# Altium schematic sheet 5.USB3.SchDoc
size 420 x 297 mm; SheetNumber: 5; SheetTotal: 13
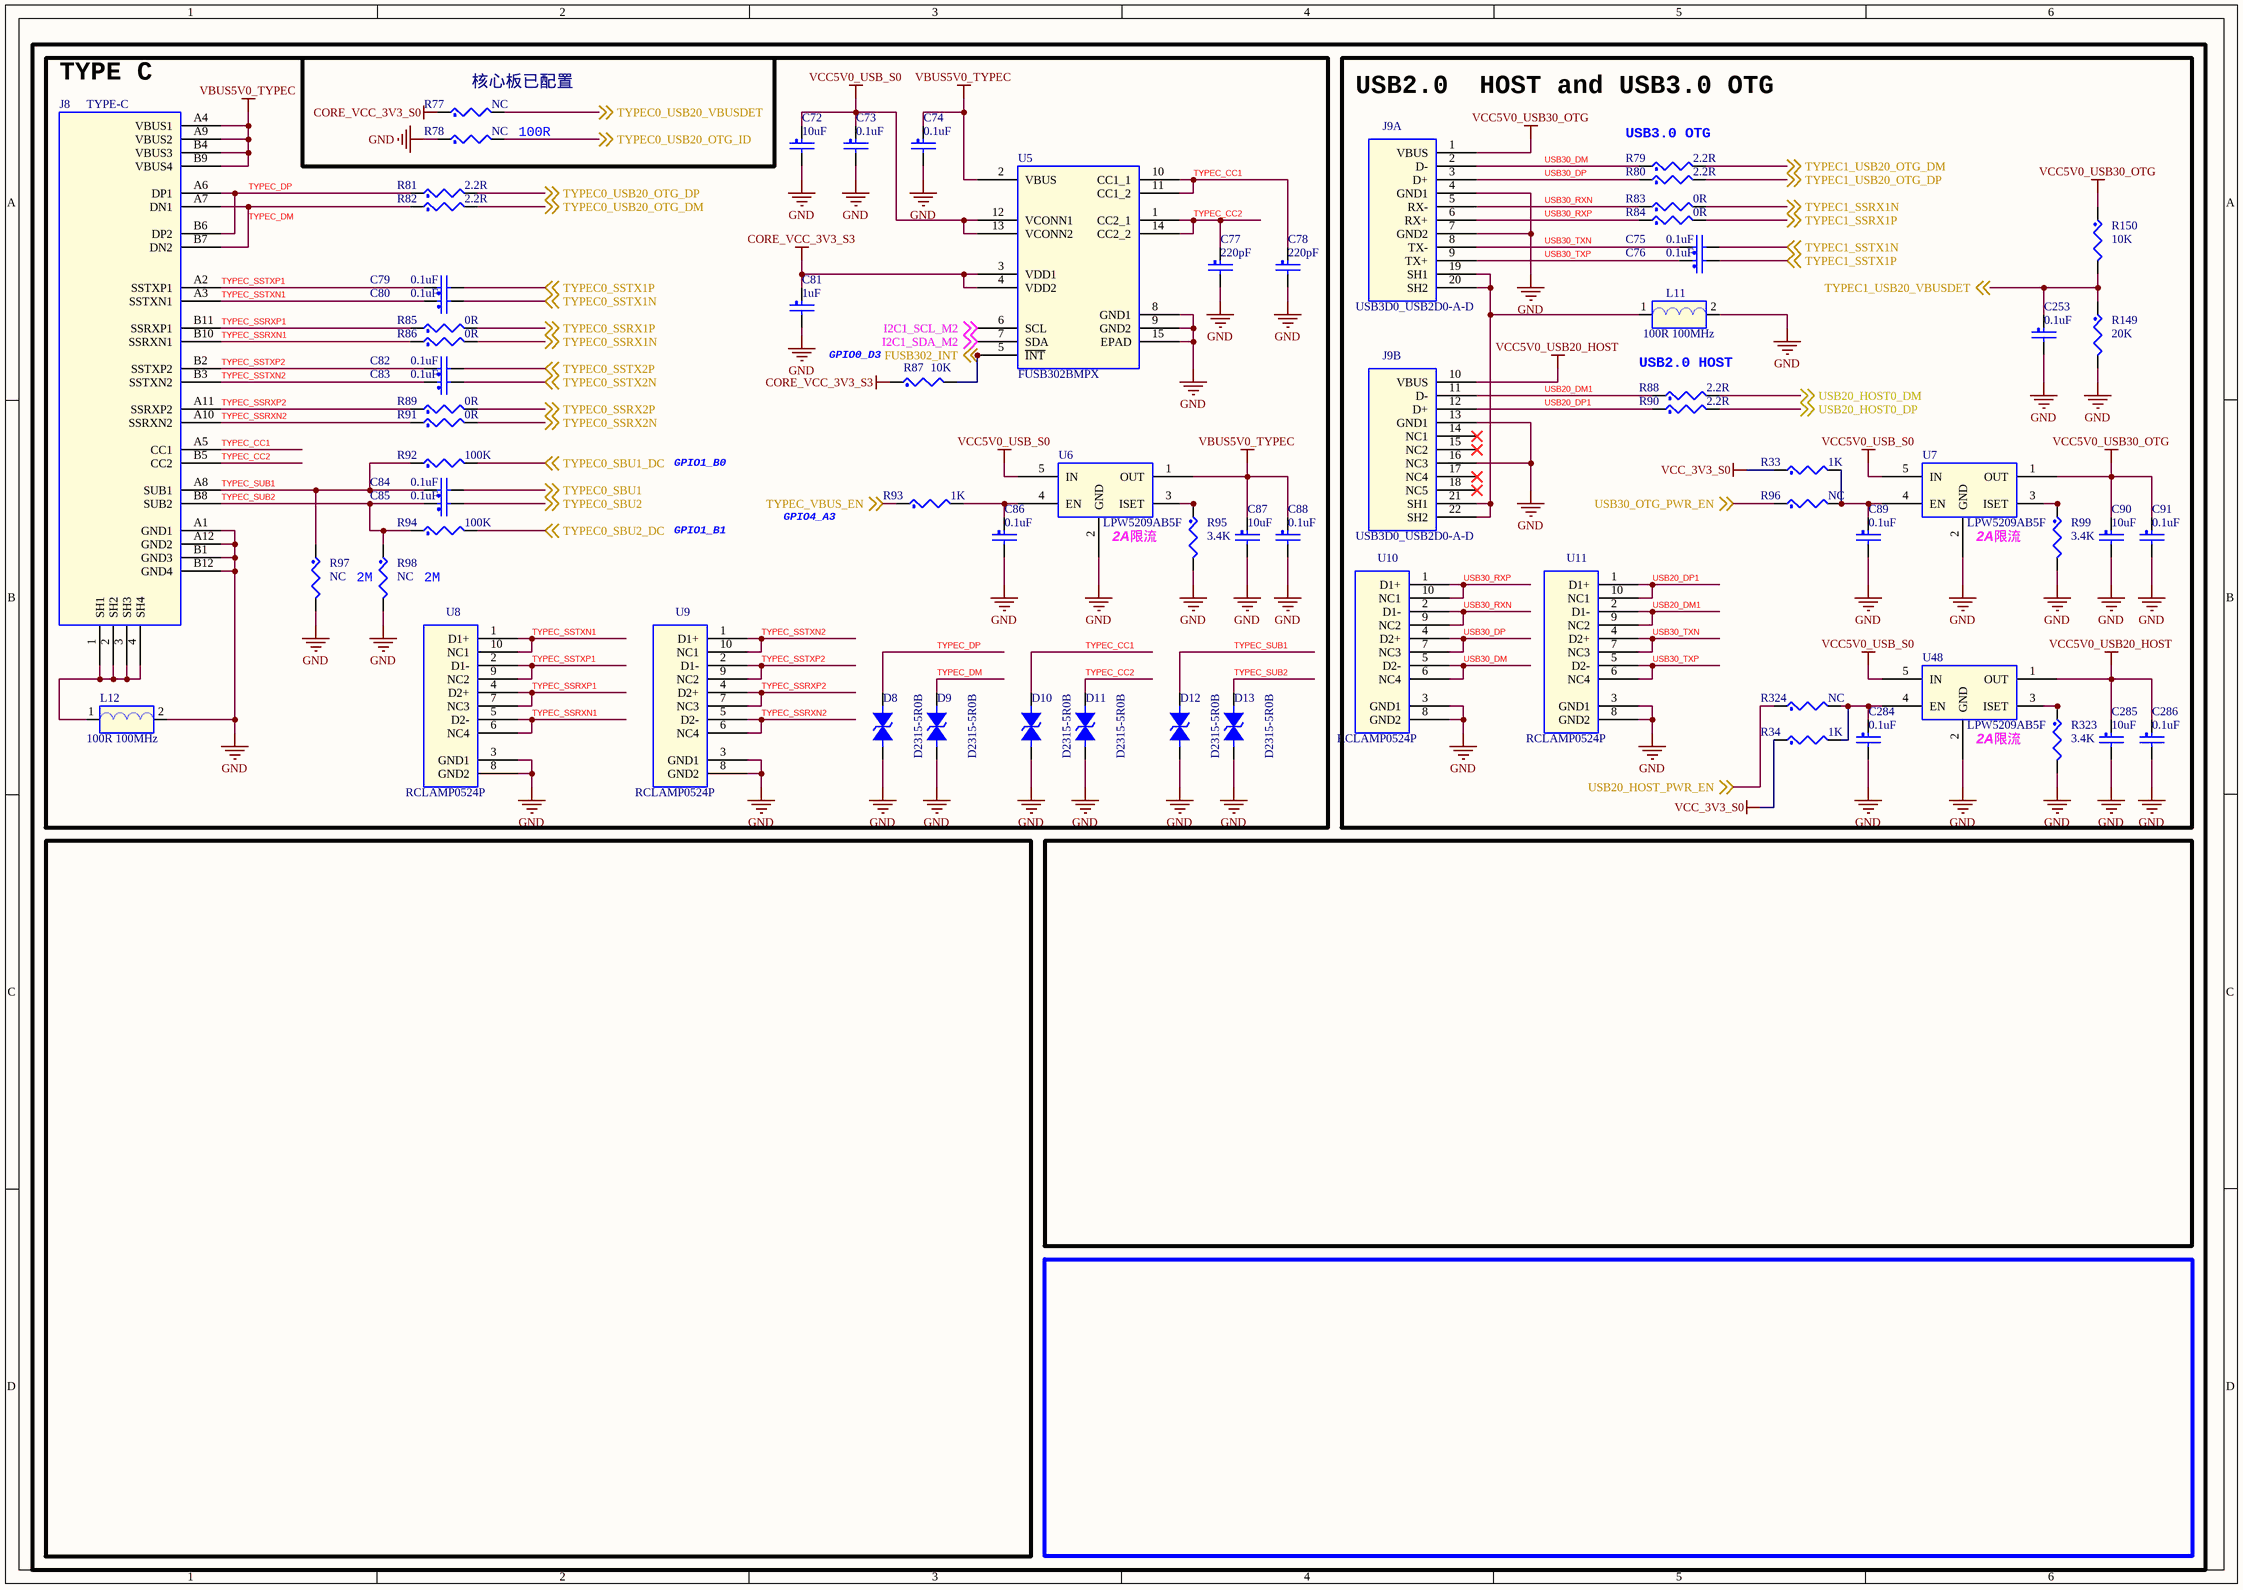
[diagram p0: 5.USB3.SchDoc]

## Parts
C72  10uF  [C0402]
C73  0.1uF  [C0402]
C74  0.1uF  [C0402]
C75  0.1uF  [C0402]
C76  0.1uF  [C0402]
C77  220pF  [C0402]
C78  220pF  [C0402]
C79  0.1uF  [C0402]
C80  0.1uF  [C0402]
C81  1uF  [C0402]
C82  0.1uF  [C0402]
C83  0.1uF  [C0402]
C84  0.1uF  [C0402]
C85  0.1uF  [C0402]
C86  0.1uF  [C0402]
C87  10uF  [C0402]
C88  0.1uF  [C0402]
C89  0.1uF  [C0402]
C90  10uF  [C0402]
C91  0.1uF  [C0402]
C253  0.1uF  [C0402]
C284  0.1uF  [C0402]
C285  10uF  [C0402]
C286  0.1uF  [C0402]
D8  D2315-5R0B  [esd0402]
D9  D2315-5R0B  [esd0402]
D10  D2315-5R0B  [esd0402]
D11  D2315-5R0B  [esd0402]
D12  D2315-5R0B  [esd0402]
D13  D2315-5R0B  [esd0402]
J8  TYPE-C  [usb-c-smd_tyc-324g]
J9  USB3D0_USB2D0-A-D  [USB3D0-AF-18P]  (parts A,B of 2)
L11  100R 100MHz  [L0603]
L12  100R 100MHz  [L0603]
R33  1K  [R0402]
R34  1K  [R0402]
R77  NC  [R0402]
R78  NC  [R0402]
R79  2.2R  [R0402]
R80  2.2R  [R0402]
R81  2.2R  [R0402]
R82  2.2R  [R0402]
R83  0R  [R0402]
R84  0R  [R0402]
R85  0R  [R0402]
R86  0R  [R0402]
R87  10K  [R0402]
R88  2.2R  [R0402]
R89  0R  [R0402]
R90  2.2R  [R0402]
R91  0R  [R0402]
R92  100K  [R0402]
R93  1K  [R0402]
R94  100K  [R0402]
R95  3.4K  [R0402]
R96  NC  [R0402]
R97  NC  [R0402]
R98  NC  [R0402]
R99  3.4K  [R0402]
R149  20K  [R0402]
R150  10K  [R0402]
R323  3.4K  [R0402]
R324  NC  [R0402]
U5  FUSB302BMPX  [WQFN14-0R50-2R5X2R5EP1R45X1R45]
U6  LPW5209AB5F  [SOT23-5]
U7  LPW5209AB5F  [SOT23-5]
U8  RCLAMP0524P  [USON_10]
U9  RCLAMP0524P  [USON_10]
U10  RCLAMP0524P  [USON_10]
U11  RCLAMP0524P  [USON_10]
U48  LPW5209AB5F  [SOT23-5]

## Blocks framed on the sheet
TYPE C: C72-C74 C77-C88 D8-D13 J8 L12 R77 R78 R81 R82 R85-R87 R89 R91-R95 R97 R98 U5 U6 U8 U9
USB2.0  HOST and USB3.0 OTG: C75 C76 C89-C91 C253 C284-C286 J9 L11 R33 R34 R79 R80 R83 R84 R88 R90 R96 R99 R149 R150 R323 R324 U7 U10 U11 U48

## Nets
CORE_VCC_3V3_S0: R77.1
CORE_VCC_3V3_S3: C81.1 R87.1 U5.3(VDD1) U5.4(VDD2)
GND: C72.2 C73.2 C74.2 C77.2 C78.2 C81.2 C86.2 C87.2 C88.2 C89.2 C90.2 C91.2 C253.2 C284.2 C285.2 C286.2 D8.1 D9.1 D10.1 D11.1 D12.1 D13.1 J8.A1(GND1) J8.A12(GND2) J8.B1(GND3) J8.B12(GND4) J9.4(GND1) J9.7(GND2) J9.13(GND1) J9.16(NC3) L11.2 L12.2 R78.1 R95.2 R97.2 R98.2 R99.2 R149.2 R323.2 U5.8(GND1) U5.9(GND2) U5.15(EPAD) U6.2(GND) U7.2(GND) U8.3(GND1) U8.8(GND2) U9.3(GND1) U9.8(GND2) U10.3(GND1) U10.8(GND2) U11.3(GND1) U11.8(GND2) U48.2(GND)
VBUS5V0_TYPEC: C74.1 C87.1 C88.1 J8.A4(VBUS1) J8.A9(VBUS2) J8.B4(VBUS3) J8.B9(VBUS4) U5.2(VBUS) U6.1(OUT)
VCC5V0_USB20_HOST: C285.1 C286.1 J9.10(VBUS) U48.1(OUT)
VCC5V0_USB30_OTG: C90.1 C91.1 J9.1(VBUS) R150.1 U7.1(OUT)
VCC5V0_USB_S0: C72.1 C73.1 U5.12(VCONN1) U5.13(VCONN2) U6.5(IN) U7.5(IN) U48.5(IN)
VCC_3V3_S0: R33.1 R34.1
FUSB302_INT: R87.2 U5.5(~{INT}) ; off-sheet FUSB302_INT
I2C1_SCL_M2: U5.6(SCL) ; off-sheet I2C1_SCL_M2
I2C1_SDA_M2: U5.7(SDA) ; off-sheet I2C1_SDA_M2
TYPEC0_SBU1: C84.2 ; off-sheet TYPEC0_SBU1
TYPEC0_SBU1_DC: R92.2 ; off-sheet TYPEC0_SBU1_DC
TYPEC0_SBU2: C85.2 ; off-sheet TYPEC0_SBU2
TYPEC0_SBU2_DC: R94.2 ; off-sheet TYPEC0_SBU2_DC
TYPEC0_SSRX1N: R86.2 ; off-sheet TYPEC0_SSRX1N
TYPEC0_SSRX1P: R85.2 ; off-sheet TYPEC0_SSRX1P
TYPEC0_SSRX2N: R91.2 ; off-sheet TYPEC0_SSRX2N
TYPEC0_SSRX2P: R89.2 ; off-sheet TYPEC0_SSRX2P
TYPEC0_SSTX1N: C80.2 ; off-sheet TYPEC0_SSTX1N
TYPEC0_SSTX1P: C79.2 ; off-sheet TYPEC0_SSTX1P
TYPEC0_SSTX2N: C83.2 ; off-sheet TYPEC0_SSTX2N
TYPEC0_SSTX2P: C82.2 ; off-sheet TYPEC0_SSTX2P
TYPEC0_USB20_OTG_DM: R82.2 ; off-sheet TYPEC0_USB20_OTG_DM
TYPEC0_USB20_OTG_DP: R81.2 ; off-sheet TYPEC0_USB20_OTG_DP
TYPEC0_USB20_OTG_ID: R78.2 ; off-sheet TYPEC0_USB20_OTG_ID
TYPEC0_USB20_VBUSDET: R77.2 ; off-sheet TYPEC0_USB20_VBUSDET
TYPEC1_SSRX1N: R83.2 ; off-sheet TYPEC1_SSRX1N
TYPEC1_SSRX1P: R84.2 ; off-sheet TYPEC1_SSRX1P
TYPEC1_SSTX1N: C75.2 ; off-sheet TYPEC1_SSTX1N
TYPEC1_SSTX1P: C76.2 ; off-sheet TYPEC1_SSTX1P
TYPEC1_USB20_OTG_DM: R79.2 ; off-sheet TYPEC1_USB20_OTG_DM
TYPEC1_USB20_OTG_DP: R80.2 ; off-sheet TYPEC1_USB20_OTG_DP
TYPEC1_USB20_VBUSDET: C253.1 R149.1 R150.2 ; off-sheet TYPEC1_USB20_VBUSDET
TYPEC_CC1: C78.1 D10.2 J8.A5(CC1) U5.10(CC1_1) U5.11(CC1_2)
TYPEC_CC2: C77.1 D11.2 J8.B5(CC2) U5.1(CC2_1) U5.14(CC2_2)
TYPEC_DM: D9.2 J8.A7(DN1) J8.B7(DN2) R82.1
TYPEC_DP: D8.2 J8.A6(DP1) J8.B6(DP2) R81.1
TYPEC_SSRXN1: J8.B10(SSRXN1) R86.1 U8.5(D2-) U8.6(NC4)
TYPEC_SSRXN2: J8.A10(SSRXN2) R91.1 U9.5(D2-) U9.6(NC4)
TYPEC_SSRXP1: J8.B11(SSRXP1) R85.1 U8.4(D2+) U8.7(NC3)
TYPEC_SSRXP2: J8.A11(SSRXP2) R89.1 U9.4(D2+) U9.7(NC3)
TYPEC_SSTXN1: C80.1 J8.A3(SSTXN1) U8.1(D1+) U8.10(NC1)
TYPEC_SSTXN2: C83.1 J8.B3(SSTXN2) U9.1(D1+) U9.10(NC1)
TYPEC_SSTXP1: C79.1 J8.A2(SSTXP1) U8.2(D1-) U8.9(NC2)
TYPEC_SSTXP2: C82.1 J8.B2(SSTXP2) U9.2(D1-) U9.9(NC2)
TYPEC_SUB1: C84.1 D12.2 J8.A8(SUB1) R92.1 R97.1
TYPEC_SUB2: C85.1 D13.2 J8.B8(SUB2) R94.1 R98.1
TYPEC_VBUS_EN: R93.1 ; off-sheet TYPEC_VBUS_EN
USB20_DM1: J9.11(D-) R88.1 U11.2(D1-) U11.9(NC2)
USB20_DP1: J9.12(D+) R90.1 U11.1(D1+) U11.10(NC1)
USB20_HOST0_DM: R88.2 ; off-sheet USB20_HOST0_DM
USB20_HOST0_DP: R90.2 ; off-sheet USB20_HOST0_DP
USB20_HOST_PWR_EN: R324.1 ; off-sheet USB20_HOST_PWR_EN
USB30_DM: J9.2(D-) R79.1 U10.5(D2-) U10.6(NC4)
USB30_DP: J9.3(D+) R80.1 U10.4(D2+) U10.7(NC3)
USB30_OTG_PWR_EN: R96.1 ; off-sheet USB30_OTG_PWR_EN
USB30_RXN: J9.5(RX-) R83.1 U10.2(D1-) U10.9(NC2)
USB30_RXP: J9.6(RX+) R84.1 U10.1(D1+) U10.10(NC1)
USB30_TXN: C75.1 J9.8(TX-) U11.4(D2+) U11.7(NC3)
USB30_TXP: C76.1 J9.9(TX+) U11.5(D2-) U11.6(NC4)
NetC86_1: C86.1 R93.2 U6.4(EN)
NetC89_1: C89.1 R33.2 R96.2 U7.4(EN)
NetC284_1: C284.1 R34.2 R324.2 U48.4(EN)
NetJ8_1: J8.1(SH1) J8.2(SH2) J8.3(SH3) J8.4(SH4) L12.1
NetJ9_19: J9.19(SH1) J9.20(SH2) J9.21(SH1) J9.22(SH2) L11.1
NetR95_1: R95.1 U6.3(ISET)
NetR99_1: R99.1 U7.3(ISET)
NetR323_1: R323.1 U48.3(ISET)

Not connected (* = marked no-connect by the designer): J9 14(NC1)* 15(NC2)* 17(NC4)* 18(NC5)*

## Notes on the sheet
- (near R77) 核心板已配置
- 100R
- USB3.0 OTG
- GPIO0_D3
- USB2.0 HOST
- GPIO1_B0
- GPIO1_B1
- GPIO4_A3
- (near R98) 2M
- 2M
- (near U6) 2A限流
- (near U7) 2A限流
- (near U48) 2A限流

## Library data of the parts
C72-C91 C253 C284-C286 = CAP_NP
D8-D13 = DIODE BI-DIR TRIG
J8 = TYPE-C-24P
L11 L12 = BEAD
R33 R34 R77-R99 R149 R150 R323 R324 = RES